# Altium schematic sheet BLE.SchDoc: =Project Title
size A4; DocumentNumber: 3; Revision: 1; SheetNumber: 2; SheetTotal: 4
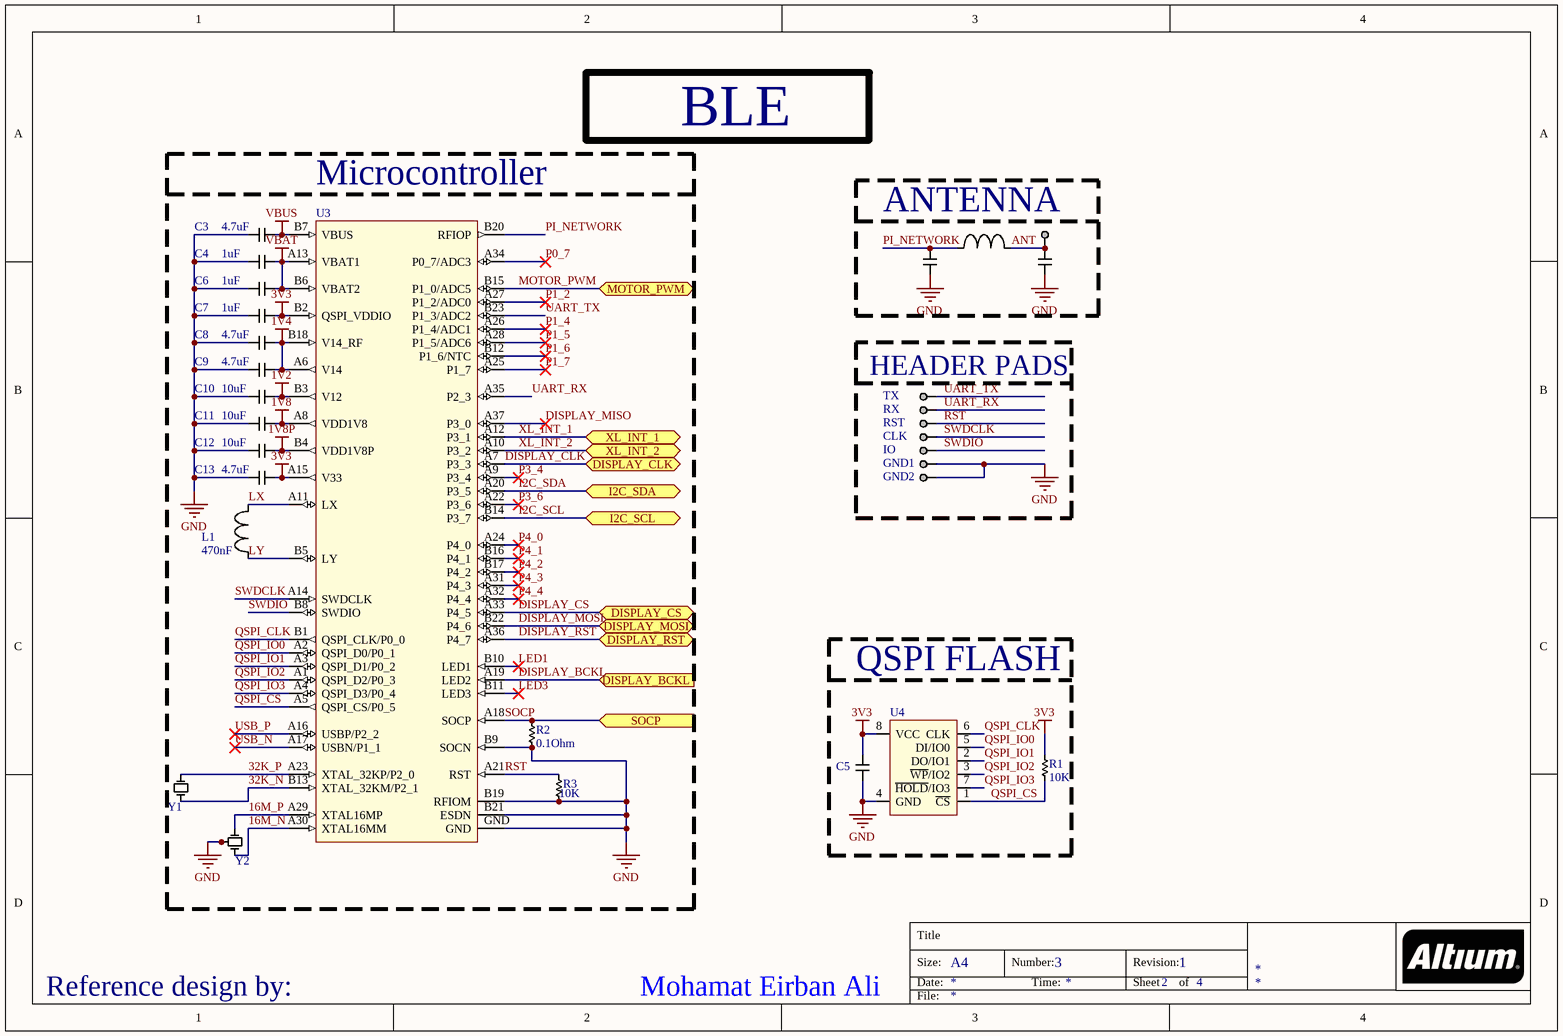
[diagram p0: BLE.SchDoc]

## Parts
ANT1  (no value)  [0.1" Header]  (no BOM)
C3  4.7uF  [CAP_0603_HIGH]
C4  1uF  [CAP_0603_HIGH]
C5  (no value)  [CAP_0603_HIGH]
C6  1uF  [CAP_0603_HIGH]
C7  1uF  [CAP_0603_HIGH]
C8  4.7uF  [CAP_0603_HIGH]
C9  4.7uF  [CAP_0603_HIGH]
C10  10uF  [CAP_0603_HIGH]
C11  10uF  [CAP_0603_HIGH]
C12  10uF  [CAP_0603_HIGH]
C13  4.7uF  [CAP_0603_HIGH]
C16  (no value)  [CAP_0402_MEDIUM]  (no BOM)
C17  (no value)  [CAP_0402_MEDIUM]  (no BOM)
CLK  (no value)  [0.1" Pad]  (no BOM)
GND1  (no value)  [0.1" Pad]  (no BOM)
GND2  (no value)  [0.1" Pad]  (no BOM)
IO  (no value)  [0.1" Pad]  (no BOM)
L1  value 470nF  [IND_0805_HIGH]
L2  (no value)  [IND_0402_MEDIUM]  (no BOM)
R1  10K  [RES_0603_HIGH]
R2  0.1Ohm  [RES_0603_HIGH]
R3  10K  [RES_0603_HIGH]
RST  (no value)  [0.1" Pad]  (no BOM)
RX  (no value)  [0.1" Pad]  (no BOM)
TX  (no value)  [0.1" Pad]  (no BOM)
U3  (no value)  [DA14683]
U4  (no value)  [W25Q128JVPIQ]
Y1  (no value)  [9HT11-32.768KDZB-T]
Y2  (no value)  [7M-16.000MEEQ-T]

## Blocks framed on the sheet
BLE: C3 C4 C6-C13 L1 R2 R3 U3 Y1 Y2
ANTENNA: ANT1 C16 C17 L2
HEADER PADS: CLK GND1 GND2 IO RST RX TX
QSPI FLASH: C5 R1 U4

## Ports
DISPLAY_BCKL (in), DISPLAY_CLK (bidir), DISPLAY_CS (bidir), DISPLAY_MOSI (bidir), DISPLAY_RST (bidir), I2C_SCL (bidir), I2C_SDA (bidir), MOTOR_PWM (bidir), SOCP (in), XL_INT_1 (bidir), XL_INT_2 (bidir)

## Nets
1V2: C10.1 U3.B3(V12)
1V4: C8.1 C9.1 U3.A6(V14) U3.B18(V14_RF)
1V8: C11.1 U3.A8(VDD1V8)
1V8P: C12.1 U3.B4(VDD1V8P)
3V3: C5.1 C7.1 C13.1 R1.2 U3.A15(V33) U3.B2(QSPI_VDDIO) U4.8(VCC)
GND: C3.2 C4.2 C5.2 C6.2 C7.2 C8.2 C9.2 C10.2 C11.2 C12.2 C13.2 C16.1 C17.1 GND1.1 GND2.1 R2.1 R3.1 U3.B9(SOCN) U3.B19(RFIOM) U3.B21(ESDN) U3.GND U4.4(GND) Y2.2 Y2.4
VBAT: C4.1 C6.1 U3.A13(VBAT1) U3.B6(VBAT2)
VBUS: C3.1 U3.B7(VBUS)
16M_N: U3.A30(XTAL16MM) Y2.3
16M_P: U3.A29(XTAL16MP) Y2.1
32K_N: U3.B13(XTAL_32KM/P2_1) Y1.1
32K_P: U3.A23(XTAL_32KP/P2_0) Y1.2
ANT: ANT1.1 C17.2 L2.1
DISPLAY_BCKL: U3.A19(LED2) ; port DISPLAY_BCKL
DISPLAY_CLK: U3.A7(P3_3) ; port DISPLAY_CLK
DISPLAY_CS: U3.A33(P4_5) ; port DISPLAY_CS
DISPLAY_MISO: U3.A37(P3_0)
DISPLAY_MOSI: U3.B22(P4_6) ; port DISPLAY_MOSI
DISPLAY_RST: U3.A36(P4_7) ; port DISPLAY_RST
I2C_SCL: U3.B14(P3_7) ; port I2C_SCL
I2C_SDA: U3.A20(P3_5) ; port I2C_SDA
LED1: U3.B10(LED1)
LED3: U3.B11(LED3)
LX: L1.2 U3.A11(LX)
LY: L1.1 U3.B5(LY)
MOTOR_PWM: U3.B15(P1_0/ADC5) ; port MOTOR_PWM
P0_7: U3.A34(P0_7/ADC3)
P1_2: U3.A27(P1_2/ADC0)
P1_4: U3.A26(P1_4/ADC1)
P1_5: U3.A28(P1_5/ADC6)
P1_6: U3.B12(P1_6/NTC)
P1_7: U3.A25(P1_7)
P3_4: U3.A9(P3_4)
P3_6: U3.A22(P3_6)
P4_0: U3.A24(P4_0)
P4_1: U3.B16(P4_1)
P4_2: U3.B17(P4_2)
P4_3: U3.A31(P4_3)
P4_4: U3.A32(P4_4)
PI_NETWORK: C16.2 L2.2 U3.B20(RFIOP)
QSPI_CLK: U3.B1(QSPI_CLK/P0_0) U4.6(CLK)
QSPI_CS: R1.1 U3.A5(QSPI_CS/P0_5) U4.1(~{CS})
QSPI_IO0: U3.A2(QSPI_D0/P0_1) U4.5(DI/IO0)
QSPI_IO1: U3.A3(QSPI_D1/P0_2) U4.2(DO/IO1)
QSPI_IO2: U3.A1(QSPI_D2/P0_3) U4.3(~{WP}/IO2)
QSPI_IO3: U3.A4(QSPI_D3/P0_4) U4.7(~{HOLD}/IO3)
RST: R3.2 RST.1 U3.A21(RST)
SOCP: R2.2 U3.A18(SOCP) ; port SOCP
SWDCLK: CLK.1 U3.A14(SWDCLK)
SWDIO: IO.1 U3.B8(SWDIO)
UART_RX: RX.1 U3.A35(P2_3)
UART_TX: TX.1 U3.B23(P1_3/ADC2)
USB_N: U3.A17(USBN/P1_1)
USB_P: U3.A16(USBP/P2_2)
XL_INT_1: U3.A12(P3_1) ; port XL_INT_1
XL_INT_2: U3.A10(P3_2) ; port XL_INT_2

## Notes on the sheet
- Microcontroller
- Reference design by:
- Mohamat Eirban Ali
- Title
- Size:
- Date:
- A4
- Number:
- Time:
- Revision:
- Sheet
- of
- File:

## Library data of the parts
ANT1 = 0.1" Header
C3 C8 C9 C13 = Capacitor_0603_2: 0603 Capacitor
C4 C6 C7 = Capacitor_0603_3: 0603 Capacitor
C5 = Capacitor_0603: 0603 Capacitor
C10-C12 = Capacitor_0603_1: 0603 Capacitor
C16 C17 = Capacitor_0402: 0402 Capacitor
CLK GND1 GND2 IO RST RX TX = 0.1" Pad
L1 = Inductor_0805: Parameter 1: CKP2012; Parameter 2: NR47M-T; Parameter 3: *; Parameter 4: *
L2 = Inductor_0402
R1 R3 = Resistor_0603_3: 0603 Resistor
R2 = Resistor_0603_4: 0603 Resistor
U3 = DA14683: SmartBond DA14683 Single-chip high-security Bluetooth 5 solution with expandable memory; Manufacturer 1: Dialog Semiconductor; Manufacturer Part Number 1: DA14683-00000A92; Supplier 1: Digi-Key; Supplier Part Number 1: DA14683-00000A92CT-ND; Stock 1: 3880; Pricing 1: 1=5.12000, 10=4.57400, 25=4.11680, 100=3.75090, 250=3.38496, 500=3.03730, 1000=2.56158 (USD); RoHS: No
U4 = W25Q128JVPIQ: FLASH - NOR Memory IC 128Mb (16M x 8) SPI - Quad I/O, QPI, DTR 133MHz  8-WSON (6x5)
Y1 = 9HT11-32.768KDZB-T: 32.768kHz ±20ppm Crystal 6pF 90 kOhms 2-SMD, No Lead; Parameter 1: 9HT11; Parameter 2: -32.76; Parameter 3: 8KDZ; Parameter 4: B-T
Y2 = 7M-16.000MEEQ-T: 16MHz ±10ppm Crystal 10pF 80 Ohms 4-SMD, No Lead; Parameter 1: 7M-16; Parameter 2: .000M; Parameter 3: EEQ-T